# Altium project USBiso.PrjPCB
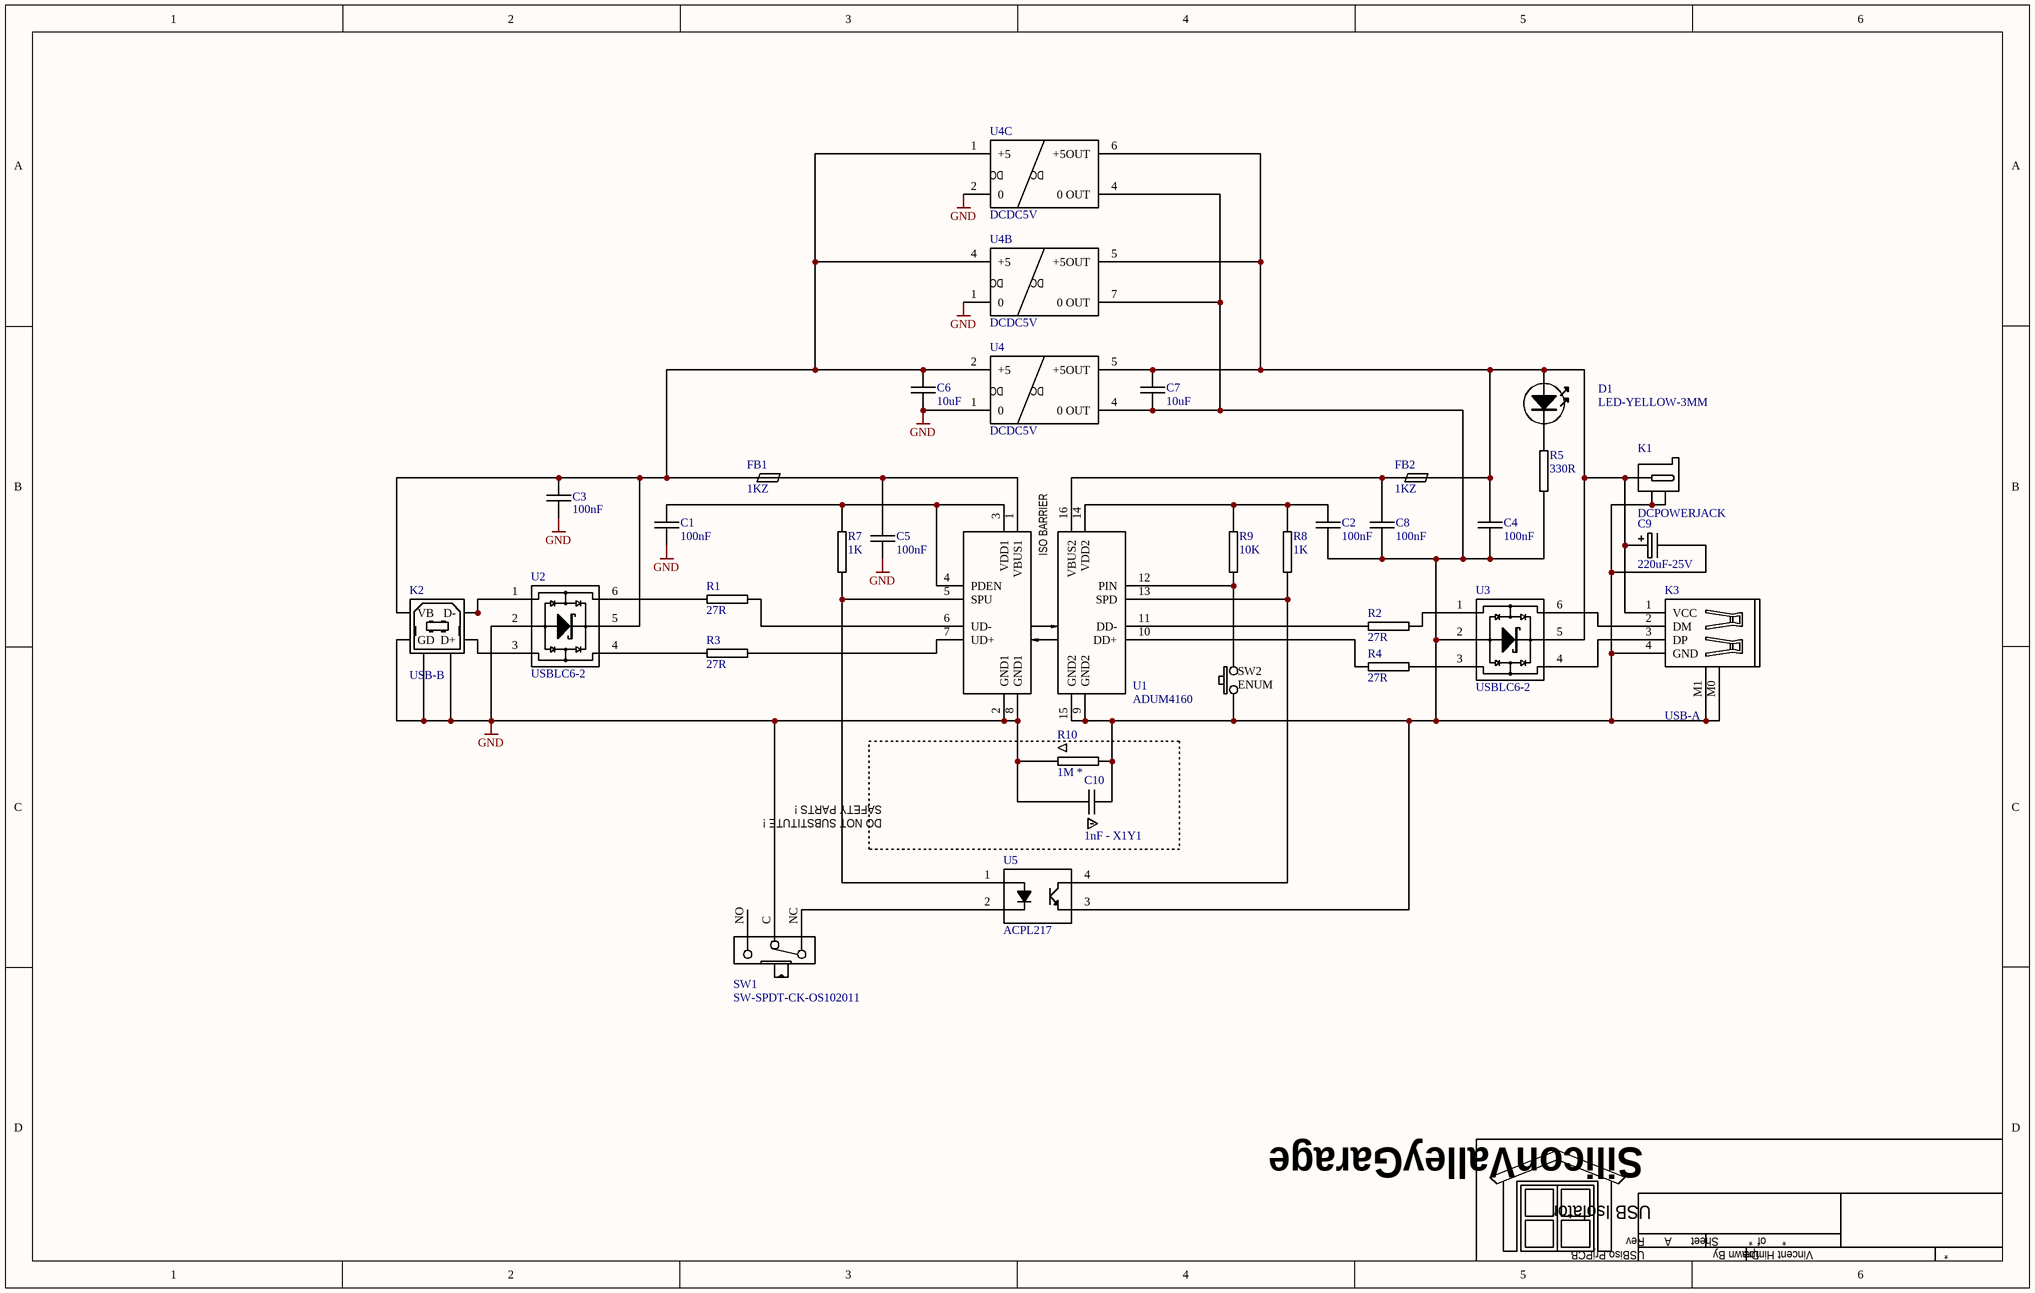
[diagram p0: USBiso.SchDoc]
1 sheet, 34 parts. Net scope: global (net labels, ports and power ports of the same name join across sheets).
Board file: USBiso.PcbDoc

## Sheet USBiso.SchDoc: USB Isolator
size B; Engineer: Vincent Himpe; Revision: A

### Parts
C1  100nF  [0805C-TBD]
C2  100nF  [0805C-TBD]
C3  100nF  [0805C-TBD]
C4  100nF  [0805C-TBD]
C5  100nF  [0805C-TBD]
C6  10uF  [0805C-GENERIC]
C7  10uF  [0805C-GENERIC]
C8  100nF  [0805C-TBD]
C9  220uF-25V  [PANACAP-F-GENERIC]
C10  1nF - X1Y1  [C-X1Y1-10MM]
D1  LED-YELLOW-3MM  [LED-3MM-YELLOW]
FB1  1KZ  [0805FB-1KZ]
FB2  1KZ  [0805FB-1KZ]
K1  DCPOWERJACK  [DCPOWER]
K2  USB-B  [USB-B]
K3  USB-A  [usb-a]
R1  27R  [0805R-27]
R2  27R  [0805R-27]
R3  27R  [0805R-27]
R4  27R  [0805R-27]
R5  330R  [0805R-330]
R7  1K  [0805R-1K]
R8  1K  [0805R-1K]
R9  10K  [0805R-10K]
R10  1M *  [R-1/4W-SAFETY]
SW1  SW-SPDT-CK-OS102011  [CK-OS102011]
SW2  ENUM  [SW-OMRONRA-Y]
U1  ADUM4160  [SO16W]
U2  USBLC6-2  [SOT23-6]
U3  USBLC6-2  [SOT23-6]
U4  DCDC5V  [VBT1-CUI]
U4B  DCDC5V  [DCDC-DIP8]
U4C  DCDC5V  [DCDC-SIP5]
U5  ACPL217  [ACPL217]

### Nets
GND: C1.2 C3.2 C5.1 C6.2 C10.2 K2.4(GD) K2.5 K2.6 R10.1 SW1.C U1.2(GND1) U1.8(GND1) U2.2(GND) U4.1(0) U4B.1(0) U4C.2(0)
NetC1_1: C1.1 R7.1 U1.3(VDD1) U1.4(PDEN)
NetC2_1: C2.1 R8.1 R9.1 U1.14(VDD2)
NetC2_2: C2.2 C4.2 C7.2 C8.2 C9.- C10.1 K1.2 K1.3 K3.4(GND) K3.M0 K3.M1 R5.1 R10.2 SW2.1 U1.9(GND2) U1.15(GND2) U3.2(GND) U4.4(0_OUT) U4B.7(0_OUT) U4C.4(0_OUT) U5.3
NetC3_1: C3.1 C6.1 FB1.1 K2.1(VB) U2.5(VBUS) U4.2(+5) U4B.4(+5) U4C.1(+5)
NetC4_1: C4.1 C7.1 C9.+ D1.A FB2.2 K1.1 K3.1(VCC) U3.5(VBUS) U4.5(+5OUT) U4B.5(+5OUT) U4C.6(+5OUT)
NetC5_2: C5.2 FB1.2 U1.1(VBUS1)
NetC8_1: C8.1 FB2.1 U1.16(VBUS2)
NetD1_K: D1.K R5.2
NetK2_2: K2.2(D-) U2.1(P1)
NetK2_3: K2.3(D+) U2.3(P2)
NetK3_2: K3.2(DM) U3.6(P4)
NetK3_3: K3.3(DP) U3.4(P3)
NetR1_1: R1.1 U2.6(P4)
NetR1_2: R1.2 U1.6(UD-)
NetR2_1: R2.1 U1.11(DD-)
NetR2_2: R2.2 U3.1(P1)
NetR3_1: R3.1 U2.4(P3)
NetR3_2: R3.2 U1.7(UD+)
NetR4_1: R4.1 U1.10(DD+)
NetR4_2: R4.2 U3.3(P2)
NetR7_2: R7.2 U1.5(SPU) U5.1(A1)
NetR8_2: R8.2 U1.13(SPD) U5.4
NetR9_2: R9.2 SW2.2 U1.12(PIN)
NetSW1_NC: SW1.NC(NC2) U5.2(K1)

Not connected (* = marked no-connect by the designer): SW1 NO

### Notes on the sheet
- SAFETY PARTS !
- DO NOT SUBSTITUTE !
- SiliconValleyGarage
- Rev
- Sheet
- Drawn By
- of
- (in symbol ADUM4160) ISO BARRIER
- (in symbol VBSD1-DIP) DC
- (in symbol VBT1-S5-S5-SMT) DC
- (in symbol VIBLSD1-SIP) DC

### Library data of the parts
C1-C5 C8 = 0805C-100nF-25V-X7R-MUR: CAPACITOR 0805 CERAMIC; Supplier 1: Digi-Key; Supplier Part Number 1: 490-1673-1-ND
C6 C7 = 0805C-4U7-25V-X5R-TDK: CAPACITOR 0805 CERAMIC; Manufacturer: TDK Corporation; Manufacturer Part Number: C2012X5R1E475K; Tolerance: ±10%; Voltage - Rated: 25V; Temperature Coefficient: X5R; Capacitance: 4.7µF; Description: CAP CER 4.7UF 25V X5R 0805; REEL: C102; Supplier 1: Digi-Key; Supplier Part Number 1: 445-4116-1-ND; Packaging: Cut Tape (CT); Operating Temperature: -55°C ~ 85°C; Supplier: Digi-Key; Thickness: 1.25mm; RoHS: RoHS Compliant; Features: General Purpose; Mounting Type: Surface Mount, MLCC; Package / Case: 0805 (2012 Metric); Lead Spacing: -; Category: Capacitors; Supplier Part Number: 445-4116-1-ND
C9 = PANACAP-220UF-25V-FK: GENERIC CAPACITOR POLARISED; Supplier 1: Digi-Key; Supplier Part Number 1: PCE3400TR-ND
C10 = C-X1Y1-10MM-1NF: CAPACITOR X1Y1 CLASS; Supplier 1: Digi-Key; Supplier Part Number 1: 445-2409-ND
FB1 FB2 = 0805FB-1KZ: FERRITE BEAD 1000 OHM 6A; Reel: F3
K1 = DCPOWERJACK: Connector, Power Jack, Mini .08", Right Angle, Thru-Hole; Manufacturer Part Number: RAPC722; Manufacturer: Switchcraft Inc.; Number of Positions/Contacts: 2 Conductors, 2 Contacts; Description: CONNN POWERJACK MINI.08" RA PCMT; Internal Switch(s): Single Switch, Normally Closed; Plug/Mating Plug Diameter: 2.1mm ID, 5.5mm OD; Gender: Male; Shielding: Unshielded; Mounting Type: Through Hole, Right Angle; Color: Black; RoHS: RoHS non-compliant; Connector Type: Jack; Features: -; Signal Lines: -; Supplier: Digi-Key; Termination: Solder Eyelet(s); Category: Connectors, Interconnects; REEL: *; Supplier 1: Digi-Key; Supplier Part Number: SC1153-ND; Supplier Part Number 1: SC1153-ND
K2 = USB-B: USB B DEVICE CONNECTOR; Text Field1: Assmann; Text Field2: AU-Y1007; Text Field3: Digi-Key; Text Field4: AE1085-ND; Text Field5: Thru-Hole; Text Field6: 1.168; NI?: *; O?: *; Section:: *
K3 = USB-A: USB A HOST CONNECTOR
R1-R4 = 0805R-27: RESISTOR 0805 1/4 WATT THIN FILM; Reel: *
R5 = 0805R-330: RESISTOR 0805 1/4 WATT THIN FILM; Reel: *
R7 R8 = 0805R-1K: RESISTOR 0805 1/4 WATT THIN FILM; Reel: *
R9 = 0805R-10K: RESISTOR 0805 1/4 WATT THIN FILM; Reel: *
R10 = TH4-1M-1/4W-SAFETY: GENERIC THROUGH HOLE 1/4 WATT RESISTOR; Supplier 1: Digi-Key; Supplier Part Number 1: 1MAACT-ND
SW1 = SW-SPDT-CK-OS102011: SWITCH DPDT; Supplier 1: Mouser; Supplier Part Number 1: 611-OS102011MA1QS1
SW2 = SW-PB-YELLOW-RA: SW-D6-R / SW-DS-S / SW-14X14 / SW-7X7
U1 = ADUM4160: USB Isolator; Supplier 1: Digi-Key; Supplier Part Number 1: ADUM4160BRWZ-ND
U2 U3 = USBLC6-2: USB ESD PROTECTION; Supplier 1: Digi-Key; Supplier Part Number 1: 497-5235-1-ND
U4 = VBT1-S5-S5-SMT: DC DC CONVERTOR 5V - 5V SMT; Supplier 1: Digi-Key; Supplier Part Number 1: 102-1397-2-ND
U4B = VBSD1-DIP: DC DC CONVERTOR 5V - 5V; Supplier 1: Digi-Key; Supplier Part Number 1: 102-1374-ND
U4C = VIBLSD1-SIP: DC DC CONVERTOR 5V - 5V
U5 = ACPL217: QUAD OPTOCOUPLER; Supplier 1: Digi-Key; Supplier Part Number 1: 516-1978-2-ND